# Altium project ADS1015_shield.PrjPcb
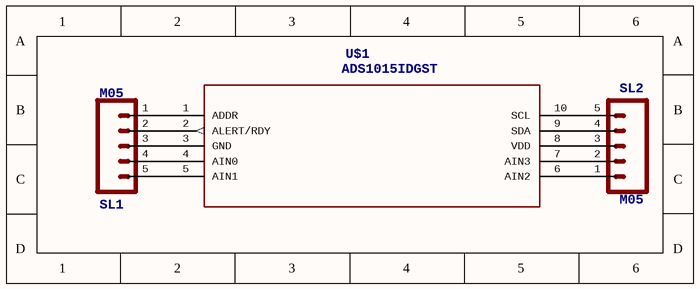
[diagram p0: ADS1015_shield.SchDoc]
1 sheet, 3 parts. Net scope: global (net labels, ports and power ports of the same name join across sheets).
Board file: ADS1015_shield.PcbDoc

## Sheet ADS1015_shield.SchDoc
size 114 x 46 mm

### Parts
SL1  M05  [05P]
SL2  M05  [05P]
U$1  ADS1015IDGST  [DGS10]

### Nets
NetSL1_1: SL1.1 U$1.1(ADDR)
NetSL1_2: SL1.2 U$1.2(ALERT/RDY)
NetSL1_3: SL1.3 U$1.3(GND)
NetSL1_4: SL1.4 U$1.4(AIN0)
NetSL1_5: SL1.5 U$1.5(AIN1)
NetSL2_1: SL2.1 U$1.6(AIN2)
NetSL2_2: SL2.2 U$1.7(AIN3)
NetSL2_3: SL2.3 U$1.8(VDD)
NetSL2_4: SL2.4 U$1.9(SDA)
NetSL2_5: SL2.5 U$1.10(SCL)

### Library data of the parts
SL1 SL2 = M05: <b>AMP QUICK CONNECTOR</b>; OC_FARNELL: unknown; OC_NEWARK: unknown
U$1 = ADS1015IDGST: MANUFACTURER_NAME: Texas Instruments; SECTION: Data Converters; COPYRIGHT: Copyright C 2015 Accelerated Designs. All rights reserved; FAMILY: ADC; MANUFACTURER_PART_NUMBER: ADS1015IDGST; RSPARTNUMBER: 7094550; VENDOR: Texas Instruments